# Altium schematic sheet 8 ddr3 termination.SchDoc
size A4; SheetNumber: 11; SheetTotal: 13
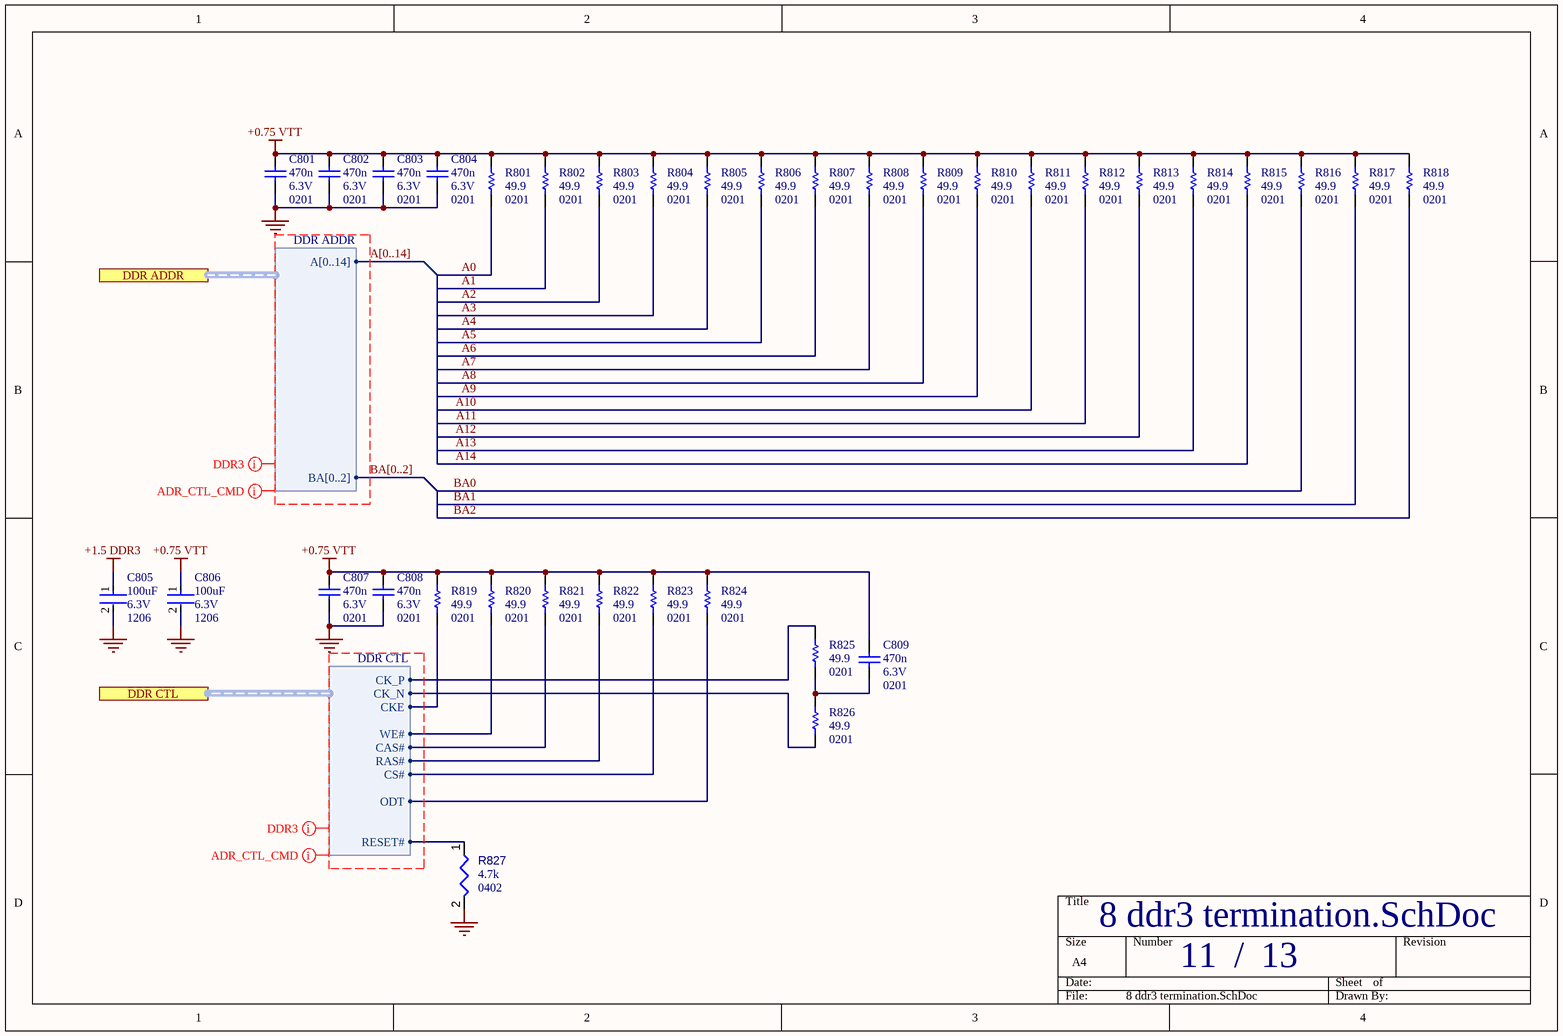
[diagram p0: 8 ddr3 termination.SchDoc]

## Parts
C801  value 470n  Voltage Rating: 6.3V  Package: 0201  [CAPC0603X33X15LL03T05]  (hidden comment: 02016D474KAT2A)
C802  value 470n  Voltage Rating: 6.3V  Package: 0201  [CAPC0603X33X15LL03T05]  (hidden comment: 02016D474KAT2A)
C803  value 470n  Voltage Rating: 6.3V  Package: 0201  [CAPC0603X33X15LL03T05]  (hidden comment: 02016D474KAT2A)
C804  value 470n  Voltage Rating: 6.3V  Package: 0201  [CAPC0603X33X15LL03T05]  (hidden comment: 02016D474KAT2A)
C805  Case Code (Imperial): 1206  Voltage Rating (DC): 6.3V  Capacitance: 100uF  [FP-C1206C-EH-MFG]  (hidden comment: C1206C107M9PACTU)
C806  Case Code (Imperial): 1206  Voltage Rating (DC): 6.3V  Capacitance: 100uF  [FP-C1206C-EH-MFG]  (hidden comment: C1206C107M9PACTU)
C807  value 470n  Voltage Rating: 6.3V  Package: 0201  [CAPC0603X33X15LL03T05]  (hidden comment: 02016D474KAT2A)
C808  value 470n  Voltage Rating: 6.3V  Package: 0201  [CAPC0603X33X15LL03T05]  (hidden comment: 02016D474KAT2A)
C809  value 470n  Voltage Rating: 6.3V  Package: 0201  [CAPC0603X33X15LL03T05]  (hidden comment: 02016D474KAT2A)
R801  value 49.9  Package: 0201  [RESC0603X28X15LL05T05]  (hidden comment: CRCW020149R9FKED)
R802  value 49.9  Package: 0201  [RESC0603X28X15LL05T05]  (hidden comment: CRCW020149R9FKED)
R803  value 49.9  Package: 0201  [RESC0603X28X15LL05T05]  (hidden comment: CRCW020149R9FKED)
R804  value 49.9  Package: 0201  [RESC0603X28X15LL05T05]  (hidden comment: CRCW020149R9FKED)
R805  value 49.9  Package: 0201  [RESC0603X28X15LL05T05]  (hidden comment: CRCW020149R9FKED)
R806  value 49.9  Package: 0201  [RESC0603X28X15LL05T05]  (hidden comment: CRCW020149R9FKED)
R807  value 49.9  Package: 0201  [RESC0603X28X15LL05T05]  (hidden comment: CRCW020149R9FKED)
R808  value 49.9  Package: 0201  [RESC0603X28X15LL05T05]  (hidden comment: CRCW020149R9FKED)
R809  value 49.9  Package: 0201  [RESC0603X28X15LL05T05]  (hidden comment: CRCW020149R9FKED)
R810  value 49.9  Package: 0201  [RESC0603X28X15LL05T05]  (hidden comment: CRCW020149R9FKED)
R811  value 49.9  Package: 0201  [RESC0603X28X15LL05T05]  (hidden comment: CRCW020149R9FKED)
R812  value 49.9  Package: 0201  [RESC0603X28X15LL05T05]  (hidden comment: CRCW020149R9FKED)
R813  value 49.9  Package: 0201  [RESC0603X28X15LL05T05]  (hidden comment: CRCW020149R9FKED)
R814  value 49.9  Package: 0201  [RESC0603X28X15LL05T05]  (hidden comment: CRCW020149R9FKED)
R815  value 49.9  Package: 0201  [RESC0603X28X15LL05T05]  (hidden comment: CRCW020149R9FKED)
R816  value 49.9  Package: 0201  [RESC0603X28X15LL05T05]  (hidden comment: CRCW020149R9FKED)
R817  value 49.9  Package: 0201  [RESC0603X28X15LL05T05]  (hidden comment: CRCW020149R9FKED)
R818  value 49.9  Package: 0201  [RESC0603X28X15LL05T05]  (hidden comment: CRCW020149R9FKED)
R819  value 49.9  Package: 0201  [RESC0603X28X15LL05T05]  (hidden comment: CRCW020149R9FKED)
R820  value 49.9  Package: 0201  [RESC0603X28X15LL05T05]  (hidden comment: CRCW020149R9FKED)
R821  value 49.9  Package: 0201  [RESC0603X28X15LL05T05]  (hidden comment: CRCW020149R9FKED)
R822  value 49.9  Package: 0201  [RESC0603X28X15LL05T05]  (hidden comment: CRCW020149R9FKED)
R823  value 49.9  Package: 0201  [RESC0603X28X15LL05T05]  (hidden comment: CRCW020149R9FKED)
R824  value 49.9  Package: 0201  [RESC0603X28X15LL05T05]  (hidden comment: CRCW020149R9FKED)
R825  value 49.9  Package: 0201  [RESC0603X28X15LL05T05]  (hidden comment: CRCW020149R9FKED)
R826  value 49.9  Package: 0201  [RESC0603X28X15LL05T05]  (hidden comment: CRCW020149R9FKED)
R827  value 4.7k  Case/Package: 0402  [RESC0402(1005)_L]  (hidden comment: Resistors,0402,4.7k)

## Ports
DDR ADDR (harness DDR ADDR), DDR CTL (harness DDR CTL)

## Harnesses
DDR ADDR: A[0..14], BA[0..2]
DDR CTL: CK_P, CK_N, CKE, WE#, CAS#, RAS#, CS#, ODT, RESET#

## Nets
+0.75 VTT: C801.1 C802.1 C803.1 C804.1 C806.1 C807.1 C808.1 C809.1 R801.2 R802.2 R803.2 R804.2 R805.2 R806.2 R807.2 R808.2 R809.2 R810.2 R811.2 R812.2 R813.2 R814.2 R815.2 R816.2 R817.2 R818.2 R819.2 R820.2 R821.2 R822.2 R823.2 R824.2
+1.5 DDR3: C805.1
GND: C801.2 C802.2 C803.2 C804.2 C805.2 C806.2 C807.2 C808.2 R827.2
A0: R801.1
A1: R802.1
A2: R803.1
A3: R804.1
A4: R805.1
A5: R806.1
A6: R807.1
A7: R808.1
A8: R809.1
A9: R810.1
A10: R811.1
A11: R812.1
A12: R813.1
A13: R814.1
A14: R815.1
BA0: R816.1
BA1: R817.1
BA2: R818.1
NetC809_2: C809.2 R825.1 R826.2
NetR819_1: R819.1 ; port DDR CTL.CKE
NetR820_1: R820.1 ; port DDR CTL.WE#
NetR821_1: R821.1 ; port DDR CTL.CAS#
NetR822_1: R822.1 ; port DDR CTL.RAS#
NetR823_1: R823.1 ; port DDR CTL.CS#
NetR824_1: R824.1 ; port DDR CTL.ODT
NetR825_2: R825.2 ; port DDR CTL.CK_P
NetR826_1: R826.1 ; port DDR CTL.CK_N
NetR827_1: R827.1 ; port DDR CTL.RESET#

## Buses and harness runs
bus A[0..14]
bus BA[0..2]

## Layout directives
net class ADR_CTL_CMD: (no net found under the mark), A[0..14], BA[0..2]
net class DDR3: (no net found under the mark), A[0..14], BA[0..2]

## Notes on the sheet
- /

## Library data of the parts
C801-C804 C807-C809 = CMP-2010-00405-1: Manufacturer: AVX Interconnect / Elco; Part Number: 02016D474KAT2A
C805 C806 = CMP-1037-05005-3: CAP CER 100UF 6.3V X5R 1206; Dielectric Material: Ceramic; Tolerance: 2%; Dissipation Factor: 5%; Min Operating Temperature: -55°C; Case Code (Metric): 3216; Depth: 1.6mm; Dielectric: X5R; Max Operating Temperature: 85°C; Packaging: Tape and Reel; Construction: Flat; Series: C; Case/Package: 1206; Radiation Hardening: No; Termination: SMD/SMT; Voltage Rating: 6.3V; Number of Pins: 2; RoHS Compliant: Yes; Height: 1.6mm; Lead Free: Lead Free; Voltage: 6.3V; REACH SVHC: No SVHC; Length: 3.2mm; Mount: Surface Mount; Package Quantity: 1; Thickness: 0.071inch; Width: 0.063inch
R801-R826 = CMP-2004-00654-1: Manufacturer: Vishay Dale; Part Number: CRCW020149R9FKED
R827 = Resistors: Resistor; Component Type: Resistors